# EasyEDA schematic design.json
TITLE: Hacker Card; REV: 1.0; Date: 2025-01-03; Sheet: 1/1; Drawn By: minodab492; Company: MinoDab Productions
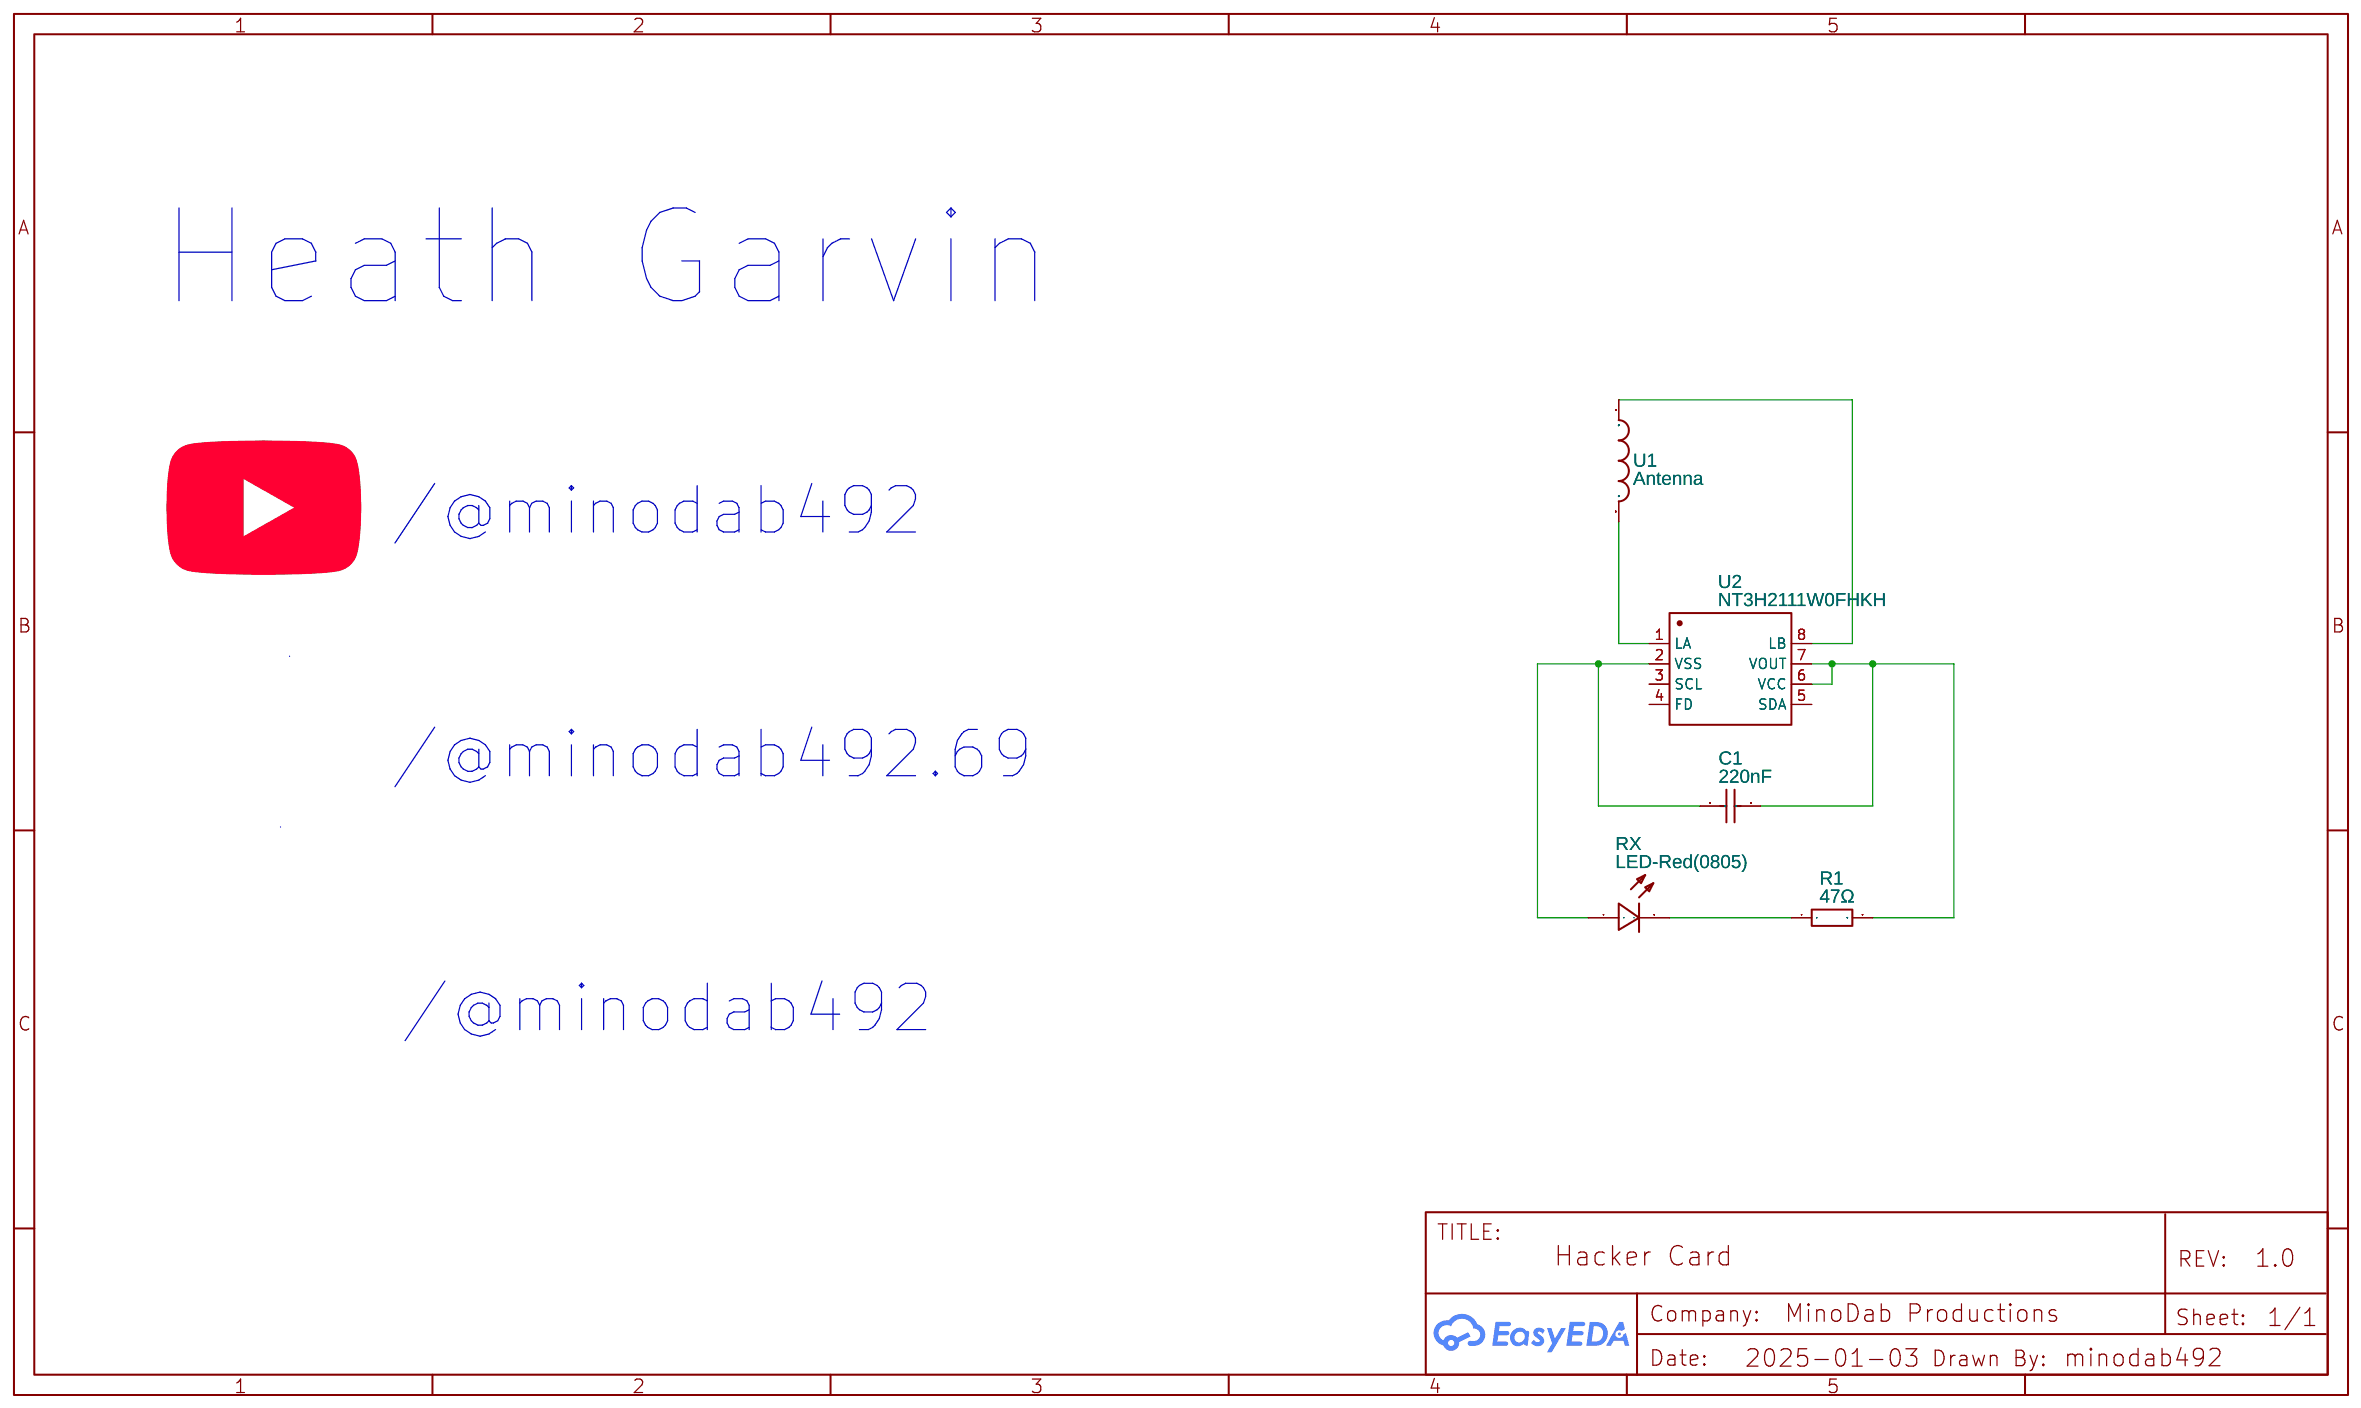
[diagram p0: schematic sheet]

## Parts
C1  220nF  [C0603]
R1  47Ω  [R0603]
RX  LED-Red(0805)  [LED-0805]
U1  Antenna  [25X48MM_NFC_ANTENNA]
U2  NT3H2111W0FHKH  [XQFN-8_L1.6-W1.6-P0.50-BL_NT3H2111W0FHKH]

## Library data of the parts
C1 = CL10B224KA8NNNC: Supplier: LCSC; Manufacturer: SAMSUNG(三星); Supplier Part: C21120; JLCPCB Part Class: Basic Part
R1 = 0603WAF470JT5E: Supplier: LCSC; Manufacturer: UNI-ROYAL(厚声); Supplier Part: C23182; JLCPCB Part Class: Basic Part
RX = LED-Red(0805): Supplier: LCSC; Manufacturer: Hubei KENTO Elec; Manufacturer Part: 17-21SUYC/TR8; Supplier Part: C2296; Contributor: pavol.machala
U1 = Antenna: Contributor: maggie.j.liu
U2 = NT3H2111W0FHKH: Contributor: LCSC; Supplier: LCSC; Supplier Part: C710403; Manufacturer: NXP(恩智浦); JLCPCB Part Class: Extended Part

## Nets
Net-(C1-1): C1.1 RX.1(+) U2.2(VSS)
Net-(C1-2): C1.2 R1.2 U2.6(VCC) U2.7(VOUT)
Net-(R1-1): R1.1 RX.2(-)
Net-(U1-P$1): U1.P$1 U2.1(LA)
Net-(U1-P$2): U1.P$2 U2.8(LB)

Not connected (* = marked no-connect by the designer): U2 3(SCL) 4(FD) 5(SDA)

## Notes on the sheet
- Heath Garvin
- /@minodab492
- /@minodab492.69
- /@minodab492
